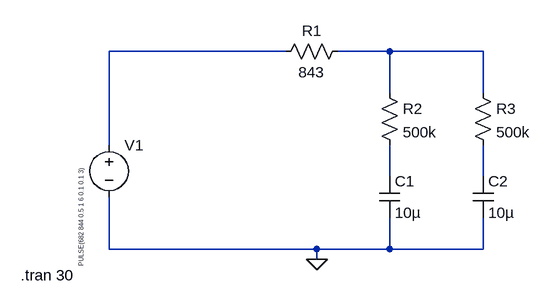
[diagram p0: schematic EasyLungModelSPICE.asc]
EasyLungModelSPICE.asc, the LTspice schematic file:
Version 4
SHEET 1 880 680
WIRE 0 -128 -272 -128
WIRE 160 -128 80 -128
WIRE 304 -128 160 -128
WIRE 160 -64 160 -128
WIRE 304 -64 304 -128
WIRE -272 16 -272 -128
WIRE 160 64 160 16
WIRE 304 64 304 16
WIRE -272 176 -272 96
WIRE 48 176 -272 176
WIRE 160 176 160 128
WIRE 160 176 48 176
WIRE 304 176 304 128
WIRE 304 176 160 176
WIRE 48 192 48 176
FLAG 48 192 0
SYMBOL voltage -272 0 R0
WINDOW 3 -43 51 VRight 0
WINDOW 123 0 0 Left 0
WINDOW 39 0 0 Left 0
SYMATTR Value PULSE(682 844 0.5 1 6 0.1 0.1 3)
SYMATTR InstName V1
SYMBOL res 96 -144 R90
WINDOW 0 0 56 VBottom 2
WINDOW 3 32 56 VTop 2
SYMATTR InstName R1
SYMATTR Value 843
SYMBOL res 144 -80 R0
SYMATTR InstName R2
SYMATTR Value 500k
SYMBOL res 288 -80 R0
SYMATTR InstName R3
SYMATTR Value 500k
SYMBOL cap 144 64 R0
SYMATTR InstName C1
SYMATTR Value 10µ
SYMBOL cap 288 64 R0
SYMATTR InstName C2
SYMATTR Value 10µ
TEXT -408 216 Left 2 !.tran 30

The netlist it stands for:
* EasyLungModelSPICE.asc
V1 N001 0 PULSE(682 844 0.5 1 6 0.1 0.1 3)
R1 N002 N001 843
R2 N002 N003 500k
R3 N002 N004 500k
C1 N003 0 10µ
C2 N004 0 10µ
.tran 30
.backanno
.end